# EAGLE design pH_to_I2C (EAGLE 6.5.0)
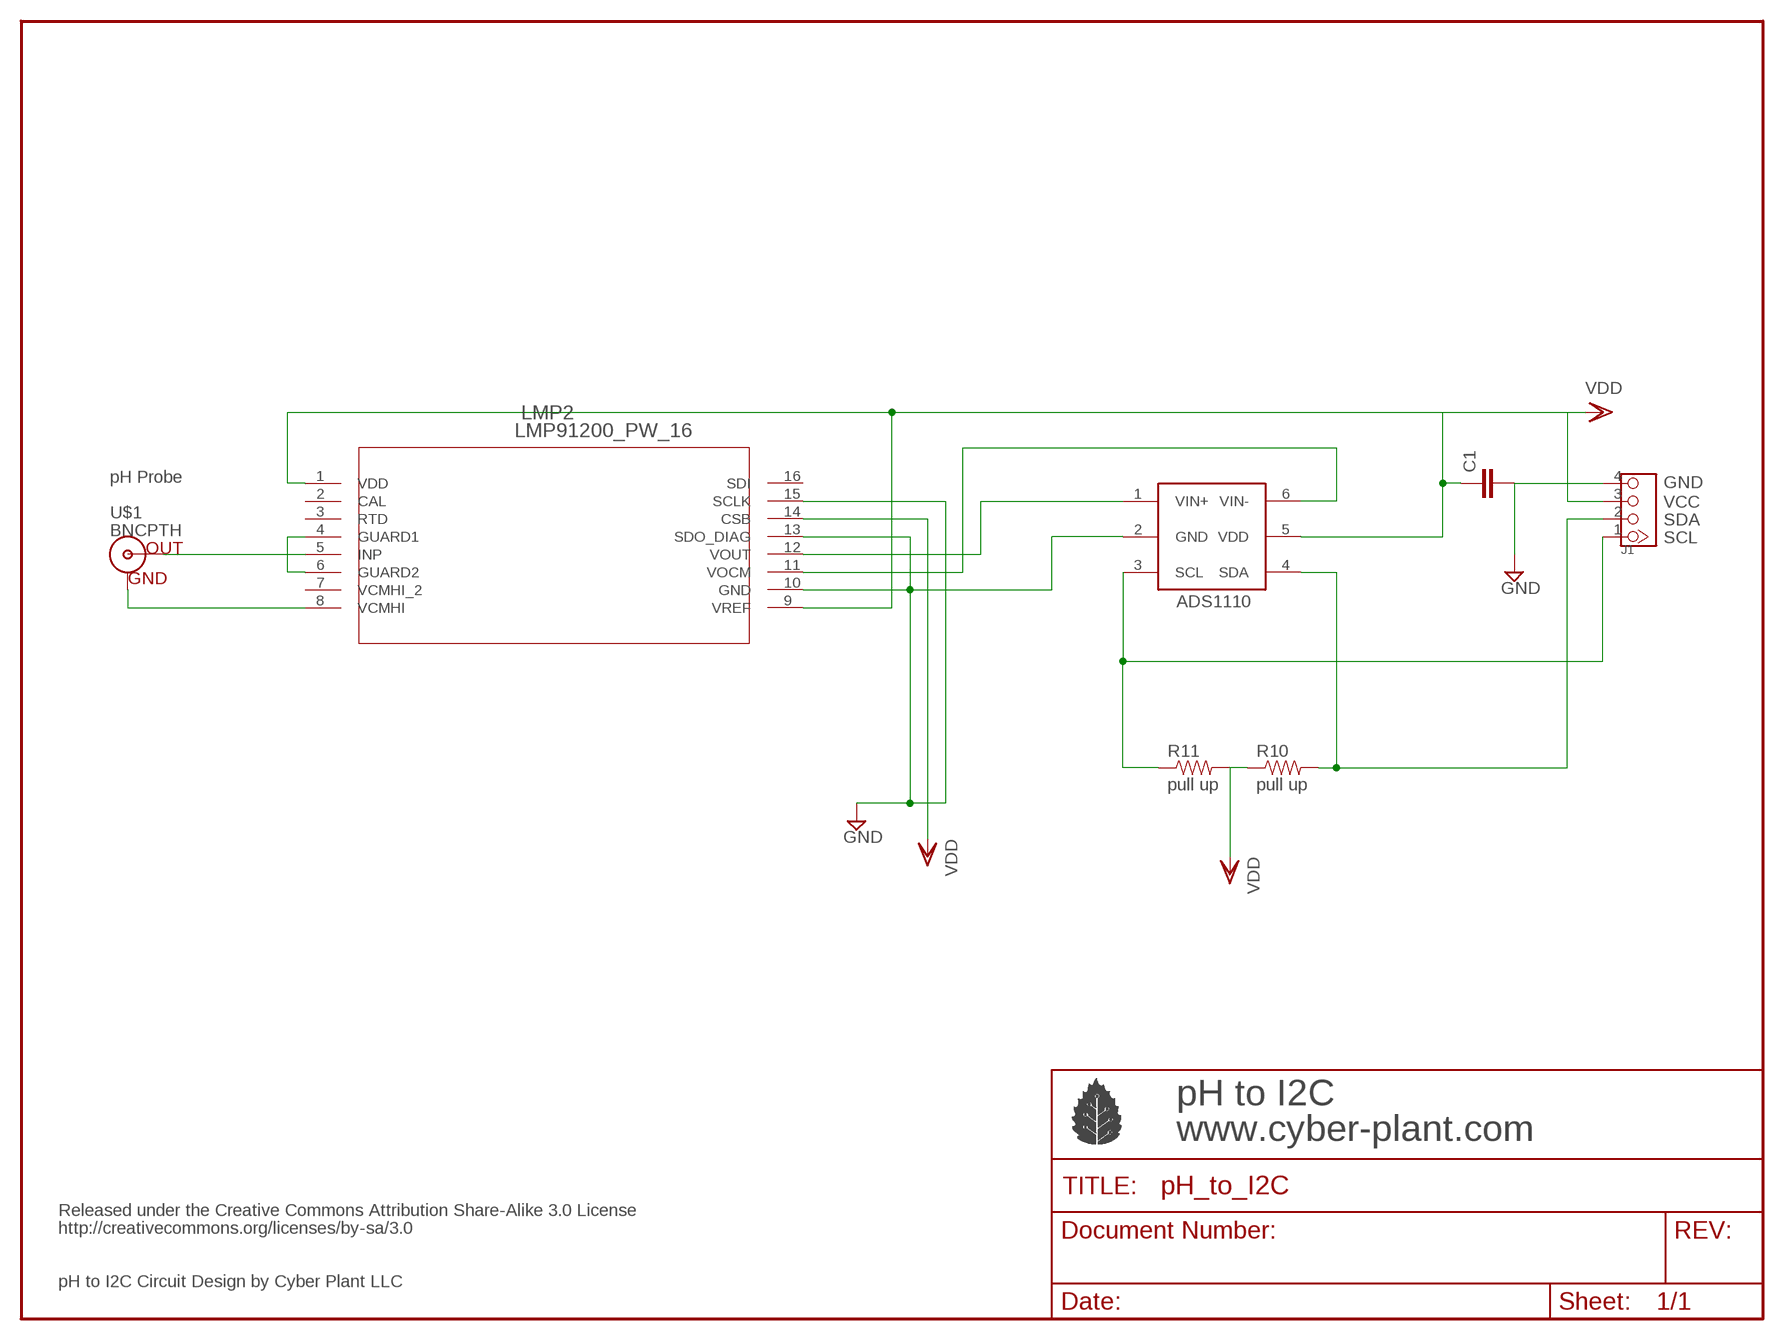
[diagram p0: schematic, sheet 1]

## Parts
C1  CAP1206  [1206]
IC1  ADS1110  [SOT-23-6]
J1  TWIG-4P-2.090D  [4P-2.0-90D]
LMP2  LMP91200_PW_16  [MTC16]
R10  pull up  RESISTORPTH-1/4W  [AXIAL-0.4]
R11  pull up  RESISTORPTH-1/4W  [AXIAL-0.4]
U$1  BNCPTH  [BNC]

## Nets
GND: C1.2 IC1.2(GND) J1.4 LMP2.10(GND) LMP2.13(SDO_DIAG) LMP2.15(SCLK)
N$3: IC1.4(SDA) J1.2 R10.P$2
N$4: IC1.1(VIN+) LMP2.12(VOUT)
N$5: IC1.6(VIN-) LMP2.11(VOCM)
N$6: IC1.3(SCL) J1.1 R11.P$1
N$15: LMP2.8(VCMHI) U$1.GND
N$16: LMP2.5(INP) U$1.S(OUT)
N$18: LMP2.4(GUARD1) LMP2.6(GUARD2)
VDD: C1.1 IC1.5(VDD) J1.3 LMP2.1(VDD) LMP2.9(VREF) LMP2.14(CSB) R10.P$1 R11.P$2
Unconnected: LMP2.2(CAL) LMP2.3(RTD) LMP2.7(VCMHI_2) LMP2.16(SDI)

## Notes on the sheet
- pH Probe
- GND
- VCC
- SDA
- SCL
- pH to I2C
- www.cyber-plant.com
- Released under the Creative Commons Attribution Share-Alike 3.0 License
- http://creativecommons.org/licenses/by-sa/3.0
- pH to I2C Circuit Design by Cyber Plant LLC

## Library data of the parts
C1 = SparkFun:CAP: Capacitor Standard 0603 ceramic capacitor, and 0.1" leaded capacitor.
IC1 = ads11xx:ADS1110: Analog/Digital conventer i2c Bus max: 2.048v
J1 = Connector_cp:TWIG-4P-2.0
LMP2 = LMP91200:LMP91200_PW_16; BASEPN: LMP91200; DATASHEETURL: http://www.ti.com/lit/ds/symlink/lmp91200.pdf; DESCRIPTION: Configurable AFE for Low-Power Chemical Sensing Applications; MANUFACTURER: Texas Instruments; MANUFACTURER_PART_NUMBER: lmp91200_pw_16; NSC_PACKAGEREFERENCE: MTC16; VENDOR: Texas Instruments
R10 R11 = SparkFun:RESISTOR: Resistor Basic schematic elements and footprints for 0603, 1206, and PTH resistors.; PROD_ID: RES-00824
U$1 = SparkFun:BNC: BNC Connector, Mouser Part# 5227161

## Board
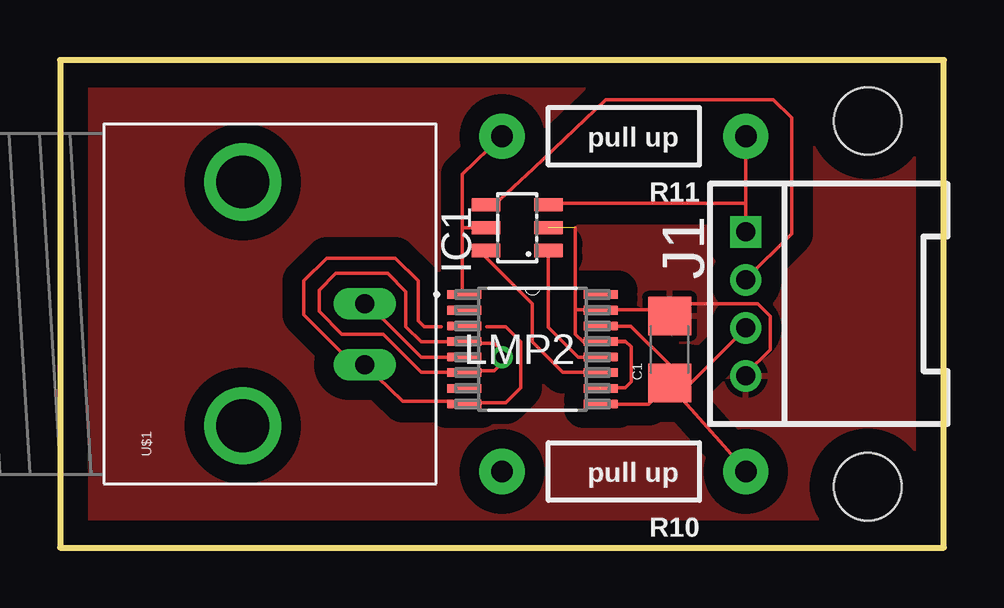
[diagram p1: board, top side]
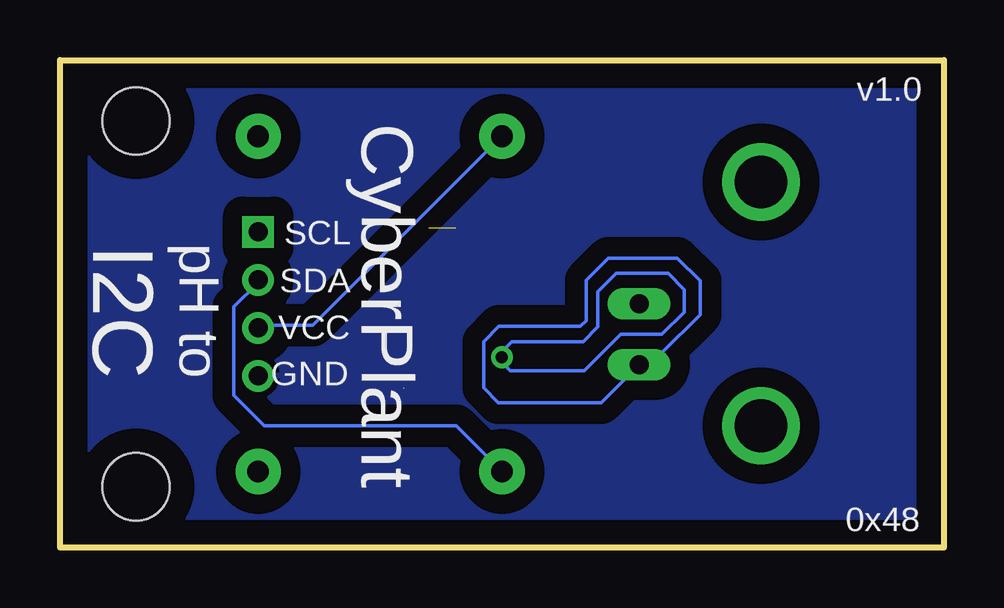
[diagram p2: board, bottom side, seen from below]

Size 36.83 x 20.32 mm. Coordinates in mm from the lower left corner, seen from the top.
Outline: 0,20.32 0,0 36.83,0 36.83,20.32 0,20.32
Copper layers (1*16): Top 0.035mm / dielectric 1.5mm / Bottom 0.035mm
Design rules "default *": minimum track width 6mil, minimum drill 12mil, track to track 27mil, track to pad 10mil, pad to pad 10mil, via to via 10mil, smd to smd 10mil, copper to edge 40mil, drill to drill 12mil, minimum pad ring 10mil, minimum via ring 8mil, stop-mask expansion 4mil, vias tented up to drill 0mil, thermal gap 10mil
Holes 2.8 mm at 33.66,17.78 33.66,2.54

### Footprints (pad centres in the part's own frame; a part is rotated, then mirrored left to right if it is on the bottom)
1206 = smd 1.6 x 1.8: 1 -1.4,0; 2 1.4,0
SOT-23-6 = smd 0.55 x 1.2: 1 -0.95,-1.3; 2 0,-1.3; 3 0.95,-1.3; 4 0.95,1.3; 5 0,1.3; 6 -0.95,1.3
4P-2.0-90D = drill 0.8 pad 1.27 square: 1 -3,0 | drill 0.8 pad 1.27: 2 -1,0; 3 1,0; 4 3,0
MTC16 = smd 1.422 x 0.356: 1 -2.845,2.286; 2 -2.845,1.626; 3 -2.845,0.965; 4 -2.845,0.33; 5 -2.845,-0.33; 6 -2.845,-0.965; 7 -2.845,-1.626; 8 -2.845,-2.286; 9 2.845,-2.286; 10 2.845,-1.626; 11 2.845,-0.965; 12 2.845,-0.33; 13 2.845,0.33; 14 2.845,0.965; 15 2.845,1.626; 16 2.845,2.286
AXIAL-0.4 = drill 0.9 pad 1.88: P$1 -5.08,0; P$2 5.08,0
BNC = drill 2.2: 3 -5.08,5.08; 4 5.08,5.08 | drill 0.8 long: GND -2.54,0; S 0,0

### Placement (x,y rotation side)
C1  25.4,8.25 90 top
IC1  19.05,13.33 90 top
J1  28.57,10.16 270 top
LMP2  19.69,8.27 0 top
R10  23.5,3.18 180 top
R11  23.5,17.14 180 top
U$1  12.7,10.16 90 top

### Tracks (layer width: path | path; a pad name or v marks a point on that pad's centre or on a via)
GND  (2 unrouted)
  Top 0.152: 21.46,8.89 21.46,13.33 | 21.46,8.89 21.48,9.91 22.48,9.91 LMP2.15 22.58,9.91 25.38,9.91 | 23.55,8.61 23.8,8.38 23.8,6.91 23.55,6.65 22.48,6.65 | 21.46,8.89 21.79,8.58 23.52,8.58 23.55,8.61 | 22.48,8.64 LMP2.13 22.54,8.61 23.55,8.61 | 25.38,9.91 25.4,10.16 29.08,10.16 29.59,9.65 29.59,8.25 28.57,7.24 J1.4 | 25.38,9.91 C1.2
  pour Top (isolate 0.813): 0,20.32 36.83,20.32 36.83,0 0,0
  pour Bottom (isolate 0.813): 0,20.32 36.83,20.32 36.83,0 0,0
N$3
  Top 0.152: J1.2 28.57,11.18 30.48,13.08 30.48,17.91 29.72,18.67 29.65,18.67 22.73,18.67 19.75,15.81 18.03,14.22 17.78,14.22 IC1.4
  Bottom 0.152: R10.P$2 20.32,5.08 28.32,5.08 29.59,6.35 29.59,10.03 28.57,11.05 J1.2
N$4
  Top 0.152: IC1.1 20.35,9.18 21.59,7.94 LMP2.12
N$5
  Top 0.152: IC1.6 17.75,12.1 19.69,10.16 19.69,8.57 20.96,7.3 LMP2.11
N$6
  Top 0.152: 28.57,14.35 20.45,14.35 IC1.3 | R11.P$1 28.57,14.35 | 28.57,14.35 J1.1
N$7
  Top 0.152: 16.51,7.3 15.05,7.3 13.46,8.89 11.75,8.89 10.79,9.84 10.79,10.73 11.49,11.43 13.65,11.43 14.42,10.67 14.42,9.21 15.05,8.57 16.83,8.57
N$8
  Top 0.152: 16.83,6.03 18.57,6.03 19.2,6.67 19.2,8.57 18.57,9.21 17.78,9.21
N$9  (via drill 0.5)
  other vias: 18.41,7.94
N$10
  Bottom 0.152: 18.41,7.98 18.41,7.72 18.06,7.37 14.99,7.37 13.46,8.89 11.75,8.89 10.82,9.82 10.82,10.76 11.49,11.43 13.65,11.43 14.42,10.67 14.42,9.21 15.04,8.58 18.01,8.58 18.39,8.2 18.39,7.98
N$11
  Bottom 0.152: 12.65,7.67 11.75,7.67 11.75,8.13 10.16,9.72 10.16,11.11 11.11,12.07 13.98,12.07 14.9,11.15 14.9,9.55 14.9,9.46 15.15,9.22 17.8,9.22
N$12
  Bottom 0.152: 17.76,9.22 18.54,9.22 19.18,8.58 19.18,6.65 18.57,6.04 14.28,6.04 12.7,7.62
N$15
  Top 0.152: LMP2.8 16.76,6.1 14.29,6.1 U$1.GND 11.75,7.62 11.75,8.13 10.16,9.72 10.16,11.11 11.11,12.07 13.97,12.07 14.92,11.11 14.92,9.46 15.18,9.21 15.88,9.21
N$16
  Top 0.152: U$1.S 12.83,10.16 15.05,7.94 LMP2.5
N$18
  Top 0.152: LMP2.6 16.89,7.37 18.09,7.37 18.4,7.68 18.4,8.19 18.09,8.51 16.89,8.51 LMP2.4
VDD
  Top 0.152: 16.76,13.33 IC1.5 | 16.76,13.33 16.76,10.67 LMP2.1 16.89,10.54 | 16.76,13.33 16.76,15.56 R11.P$2 | 25.78,6.35 27.81,4.06 R10.P$1 | 25.78,6.35 25.4,6.73 C1.1 | 25.78,6.35 J1.3 | 25.78,6.35 C1.1 | LMP2.9 24.53,5.98 C1.1 | LMP2.14 23.79,9.23 25.4,7.62 C1.1
  Bottom 0.152: R11.P$2 26.29,9.27 28.57,9.27 J1.3

### Text on the board
bPlace: v1.0 | SCL | SDA | CyberPlant | VCC | pH to | I2C | GND | 0x48